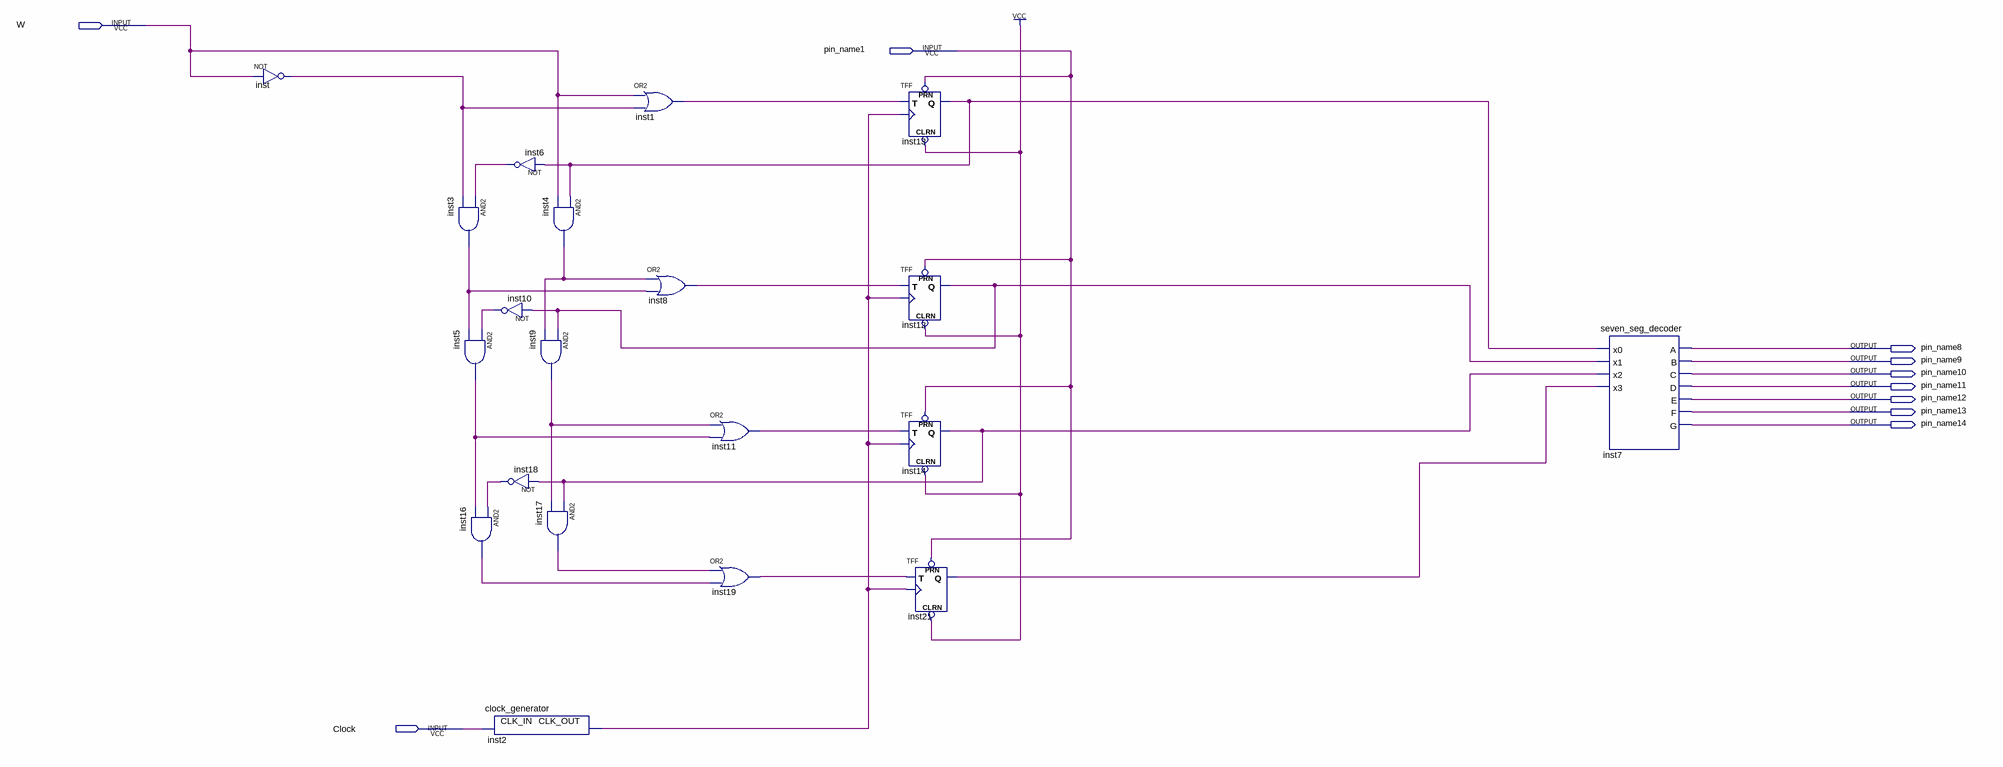
[diagram p0: schematic sheet]
// Quartus schematic backup.bdf as structural Verilog: 20 symbols, 10 pins
module backup (
  input  W,
  input  pin_name1,
  input  Clock,
  output pin_name8,
  output pin_name9,
  output pin_name10,
  output pin_name11,
  output pin_name12,
  output pin_name13,
  output pin_name14
);

  wire inst1_out, inst2_clk_out, inst3_out, inst4_out, inst5_out, inst6_out, inst8_out, inst9_out,
       inst10_out, inst11_out, inst12_q, inst13_q, inst14_q, inst16_out, inst17_out, inst18_out, inst19_out,
       inst21_q, inst_out;

  not inst (inst_out, W);
  and inst3 (inst3_out, inst6_out, inst_out);
  and inst5 (inst5_out, inst10_out, inst3_out);
  and inst16 (inst16_out, inst18_out, inst5_out);
  not inst6 (inst6_out, inst13_q);
  not inst10 (inst10_out, inst12_q);
  not inst18 (inst18_out, inst14_q);
  clock_generator inst2 (.CLK_IN(Clock), .CLK_OUT(inst2_clk_out));
  and inst4 (inst4_out, inst13_q, W);
  and inst9 (inst9_out, inst12_q, inst4_out);
  and inst17 (inst17_out, inst14_q, inst9_out);
  or inst1 (inst1_out, W, inst_out);
  or inst8 (inst8_out, inst4_out, inst3_out);
  or inst11 (inst11_out, inst9_out, inst5_out);
  or inst19 (inst19_out, inst17_out, inst16_out);
  TFF inst13 (.PRN(pin_name1), .CLRN(1'b1), .T(inst1_out), .CLK(inst2_clk_out), .Q(inst13_q));
  TFF inst12 (.PRN(pin_name1), .CLRN(1'b1), .T(inst8_out), .CLK(inst2_clk_out), .Q(inst12_q));
  TFF inst14 (.PRN(pin_name1), .CLRN(1'b1), .T(inst11_out), .CLK(inst2_clk_out), .Q(inst14_q));
  TFF inst21 (.PRN(pin_name1), .CLRN(1'b1), .T(inst19_out), .CLK(inst2_clk_out), .Q(inst21_q));
  seven_seg_decoder inst7 (
    .x0(inst13_q), .x1(inst12_q), .x2(inst14_q), .x3(inst21_q), .A(pin_name8), .B(pin_name9), .C(pin_name10),
    .D(pin_name11), .E(pin_name12), .F(pin_name13), .G(pin_name14));
endmodule
